# Altium schematic sheet 04_CapTouch.SchDoc: ECE315 Capacitive Touch
size A; Date: 01/08/2018; ApprovedBy: JSK; CheckedBy: JSK; Author: JSK; CompanyName: University of Wisconsin; DrawnBy: JSK; Engineer: JSK; Organization: ECE 315; Address1: College of Engineering; Address2: 1415 Engineering Drive; Address3: Madison, WI 53706; Address4: ECE 315 Spring 2018; Revision: A; SheetNumber: 4; SheetTotal: 6; AssemblyNumber: ECE315-S18; ApprovedDate: 4/25/2017
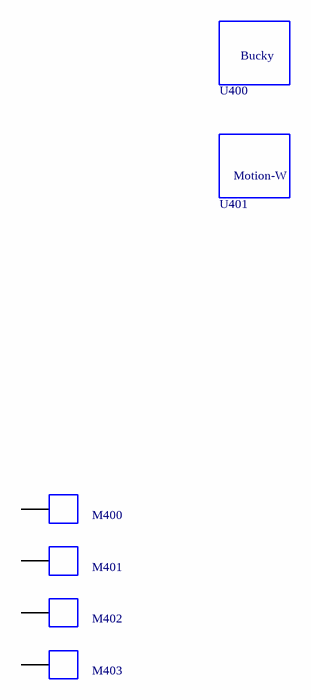
[diagram p0: 04_CapTouch.SchDoc]

## Parts
M400  Mech_TouchPad  [TouchPad]  (value not drawn)  (no BOM)
M401  Mech_TouchPad  [TouchPad]  (value not drawn)  (no BOM)
M402  Mech_TouchPad  [TouchPad]  (value not drawn)  (no BOM)
M403  Mech_TouchPad  [TouchPad]  (value not drawn)  (no BOM)
U400  Bucky  [BuckyBadger]  (value not drawn)  (no BOM)
U401  Motion_W  [Motion_W]  (value not drawn)  (no BOM)

## Nets

Not connected (* = marked no-connect by the designer): M400 1; M401 1; M402 1; M403 1

## Notes on the sheet
- Title:
- Size:
- A
- Machine:
- P.C. Board No:
- Assembly No:
- Rev:
- Sheet:
- of
- College of Engineering
- 1415 Engineering Drive
- Madison, WI 53706
- (in symbol Motion_W) Motion-W

## Library data of the parts
M400-M403 = Mech_TouchPad: Capacative Touch Sensor Pad
U400 = Bucky: Bucky Badger Image; Manufacturer Part Number: UW Bucky
U401 = Motion_W: Motion W Image; Manufacturer Part Number: UW Bucky